# Altium project MC33035_Motor_Driver.PrjPcb
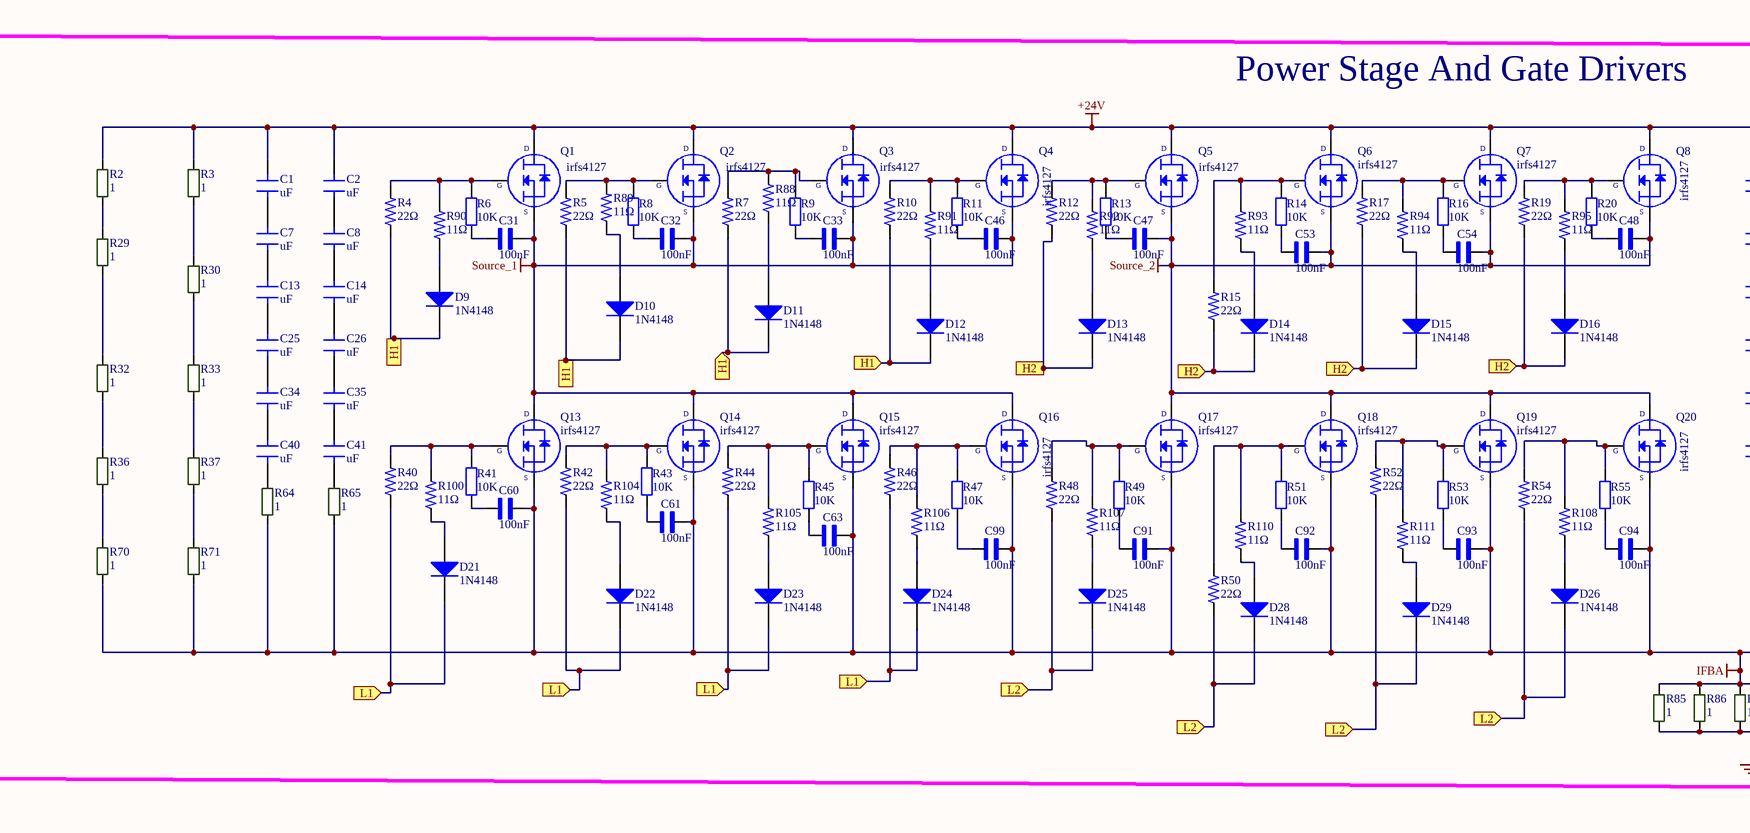
[diagram p0: Mosfet_cct.SchDoc, left]
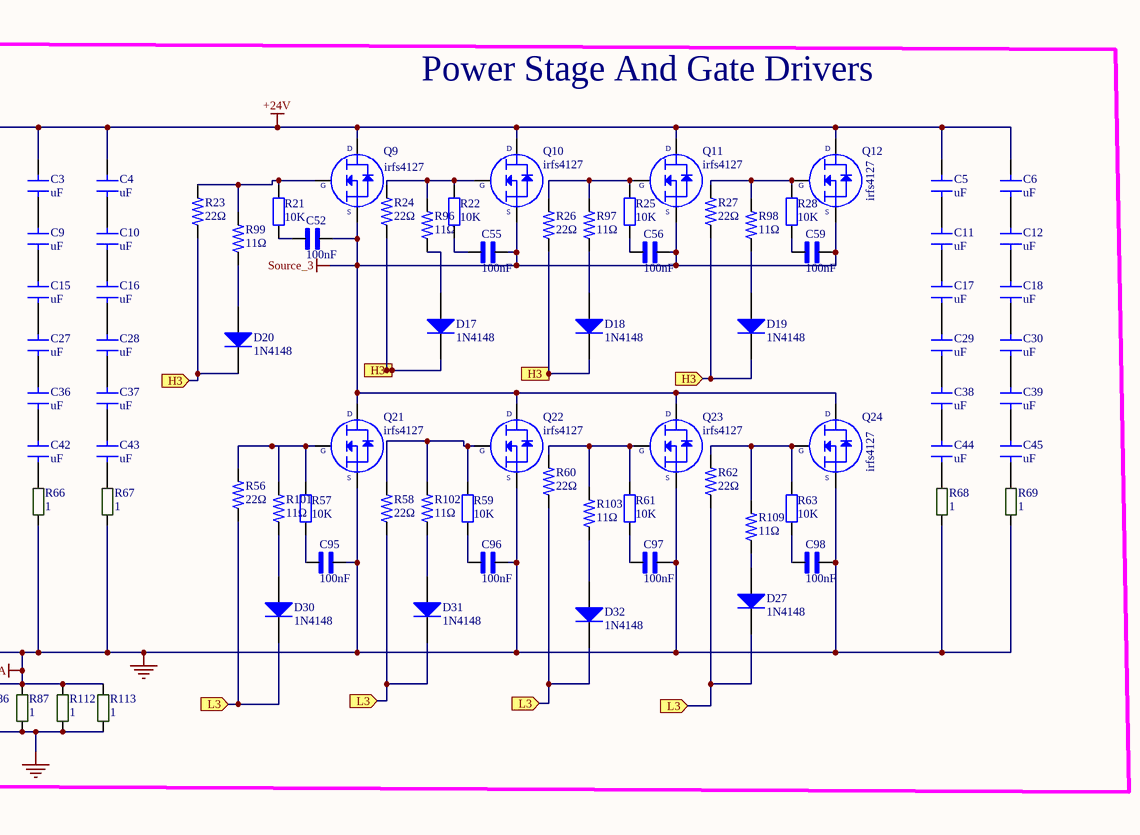
[diagram p1: Mosfet_cct.SchDoc, right]
5 sheets, 276 parts. Net scope: flat (ports and power ports of the same name join across sheets).
Board file: MC33035_Motor_Driver.PcbDoc
Sheets:
  Mosfet_cct.SchDoc
  Gate_Driver_cct.SchDoc
  Regulator_cct.SchDoc
  Parallel_Capacitor.SchDoc
  MC33035_cct.SchDoc

## Sheet Mosfet_cct.SchDoc
size A1

### Parts
C1  uF  [C-1206]
C2  uF  [C-1206]
C3  uF  [C-1206]
C4  uF  [C-1206]
C5  uF  [C-1206]
C6  uF  [C-1206]
C7  uF  [C-1206]
C8  uF  [C-1206]
C9  uF  [C-1206]
C10  uF  [C-1206]
C11  uF  [C-1206]
C12  uF  [C-1206]
C13  uF  [C-1206]
C14  uF  [C-1206]
C15  uF  [C-1206]
C16  uF  [C-1206]
C17  uF  [C-1206]
C18  uF  [C-1206]
C25  uF  [C-1206]
C26  uF  [C-1206]
C27  uF  [C-1206]
C28  uF  [C-1206]
C29  uF  [C-1206]
C30  uF  [C-1206]
C31  100nF  [C-0805W]
C32  100nF  [C-0805W]
C33  100nF  [C-0805W]
C34  uF  [C-1206]
C35  uF  [C-1206]
C36  uF  [C-1206]
C37  uF  [C-1206]
C38  uF  [C-1206]
C39  uF  [C-1206]
C40  uF  [C-1206]
C41  uF  [C-1206]
C42  uF  [C-1206]
C43  uF  [C-1206]
C44  uF  [C-1206]
C45  uF  [C-1206]
C46  100nF  [C-0805W]
C47  100nF  [C-0805W]
C48  100nF  [C-0805W]
C52  100nF  [C-0805W]
C53  100nF  [C-0805W]
C54  100nF  [C-0805W]
C55  100nF  [C-0805W]
C56  100nF  [C-0805W]
C59  100nF  [C-0805W]
C60  100nF  [C-0805W]
C61  100nF  [C-0805W]
C63  100nF  [C-0805W]
C91  100nF  [C-0805W]
C92  100nF  [C-0805W]
C93  100nF  [C-0805W]
C94  100nF  [C-0805W]
C95  100nF  [C-0805W]
C96  100nF  [C-0805W]
C97  100nF  [C-0805W]
C98  100nF  [C-0805W]
C99  100nF  [C-0805W]
D9  1N4148 Diyot  [SOD-123]  (value not drawn)
D10  1N4148 Diyot  [SOD-123]  (value not drawn)
D11  1N4148 Diyot  [SOD-123]  (value not drawn)
D12  1N4148 Diyot  [SOD-123]  (value not drawn)
D13  1N4148 Diyot  [SOD-123]  (value not drawn)
D14  1N4148 Diyot  [SOD-123]  (value not drawn)
D15  1N4148 Diyot  [SOD-123]  (value not drawn)
D16  1N4148 Diyot  [SOD-123]  (value not drawn)
D17  1N4148 Diyot  [SOD-123]  (value not drawn)
D18  1N4148 Diyot  [SOD-123]  (value not drawn)
D19  1N4148 Diyot  [SOD-123]  (value not drawn)
D20  1N4148 Diyot  [SOD-123]  (value not drawn)
D21  1N4148 Diyot  [SOD-123]  (value not drawn)
D22  1N4148 Diyot  [SOD-123]  (value not drawn)
D23  1N4148 Diyot  [SOD-123]  (value not drawn)
D24  1N4148 Diyot  [SOD-123]  (value not drawn)
D25  1N4148 Diyot  [SOD-123]  (value not drawn)
D26  1N4148 Diyot  [SOD-123]  (value not drawn)
D27  1N4148 Diyot  [SOD-123]  (value not drawn)
D28  1N4148 Diyot  [SOD-123]  (value not drawn)
D29  1N4148 Diyot  [SOD-123]  (value not drawn)
D30  1N4148 Diyot  [SOD-123]  (value not drawn)
D31  1N4148 Diyot  [SOD-123]  (value not drawn)
D32  1N4148 Diyot  [SOD-123]  (value not drawn)
Q1  irfs4127  [DPAK_TO263]
Q2  irfs4127  [DPAK_TO263]
Q3  irfs4127  [DPAK_TO263]
Q4  irfs4127  [DPAK_TO263]
Q5  irfs4127  [DPAK_TO263]
Q6  irfs4127  [DPAK_TO263]
Q7  irfs4127  [DPAK_TO263]
Q8  irfs4127  [DPAK_TO263]
Q9  irfs4127  [DPAK_TO263]
Q10  irfs4127  [DPAK_TO263]
Q11  irfs4127  [DPAK_TO263]
Q12  irfs4127  [DPAK_TO263]
Q13  irfs4127  [DPAK_TO263]
Q14  irfs4127  [DPAK_TO263]
Q15  irfs4127  [DPAK_TO263]
Q16  irfs4127  [DPAK_TO263]
Q17  irfs4127  [DPAK_TO263]
Q18  irfs4127  [DPAK_TO263]
Q19  irfs4127  [DPAK_TO263]
Q20  irfs4127  [DPAK_TO263]
Q21  irfs4127  [DPAK_TO263]
Q22  irfs4127  [DPAK_TO263]
Q23  irfs4127  [DPAK_TO263]
Q24  irfs4127  [DPAK_TO263]
R2  1  [R-2512W]
R3  1  [R-2512W]
R4  22Ω  [R-1206W]
R5  22Ω  [R-1206W]
R6  Deger: 10K  [R-0805W]  (hidden comment: RES SMD 10K OHM 1% 1/8W 0805)
R7  22Ω  [R-1206W]
R8  Deger: 10K  [R-0805W]  (hidden comment: RES SMD 10K OHM 1% 1/8W 0805)
R9  Deger: 10K  [R-0805W]  (hidden comment: RES SMD 10K OHM 1% 1/8W 0805)
R10  22Ω  [R-1206W]
R11  Deger: 10K  [R-0805W]  (hidden comment: RES SMD 10K OHM 1% 1/8W 0805)
R12  22Ω  [R-1206W]
R13  Deger: 10K  [R-0805W]  (hidden comment: RES SMD 10K OHM 1% 1/8W 0805)
R14  Deger: 10K  [R-0805W]  (hidden comment: RES SMD 10K OHM 1% 1/8W 0805)
R15  22Ω  [R-1206W]
R16  Deger: 10K  [R-0805W]  (hidden comment: RES SMD 10K OHM 1% 1/8W 0805)
R17  22Ω  [R-1206W]
R19  22Ω  [R-1206W]
R20  Deger: 10K  [R-0805W]  (hidden comment: RES SMD 10K OHM 1% 1/8W 0805)
R21  Deger: 10K  [R-0805W]  (hidden comment: RES SMD 10K OHM 1% 1/8W 0805)
R22  Deger: 10K  [R-0805W]  (hidden comment: RES SMD 10K OHM 1% 1/8W 0805)
R23  22Ω  [R-1206W]
R24  22Ω  [R-1206W]
R25  Deger: 10K  [R-0805W]  (hidden comment: RES SMD 10K OHM 1% 1/8W 0805)
R26  22Ω  [R-1206W]
R27  22Ω  [R-1206W]
R28  Deger: 10K  [R-0805W]  (hidden comment: RES SMD 10K OHM 1% 1/8W 0805)
R29  1  [R-2512W]
R30  1  [R-2512W]
R32  1  [R-2512W]
R33  1  [R-2512W]
R36  1  [R-2512W]
R37  1  [R-2512W]
R40  22Ω  [R-1206W]
R41  Deger: 10K  [R-0805W]  (hidden comment: RES SMD 10K OHM 1% 1/8W 0805)
R42  22Ω  [R-1206W]
R43  Deger: 10K  [R-0805W]  (hidden comment: RES SMD 10K OHM 1% 1/8W 0805)
R44  22Ω  [R-1206W]
R45  Deger: 10K  [R-0805W]  (hidden comment: RES SMD 10K OHM 1% 1/8W 0805)
R46  22Ω  [R-1206W]
R47  Deger: 10K  [R-0805W]  (hidden comment: RES SMD 10K OHM 1% 1/8W 0805)
R48  22Ω  [R-1206W]
R49  Deger: 10K  [R-0805W]  (hidden comment: RES SMD 10K OHM 1% 1/8W 0805)
R50  22Ω  [R-1206W]
R51  Deger: 10K  [R-0805W]  (hidden comment: RES SMD 10K OHM 1% 1/8W 0805)
R52  22Ω  [R-1206W]
R53  Deger: 10K  [R-0805W]  (hidden comment: RES SMD 10K OHM 1% 1/8W 0805)
R54  22Ω  [R-1206W]
R55  Deger: 10K  [R-0805W]  (hidden comment: RES SMD 10K OHM 1% 1/8W 0805)
R56  22Ω  [R-1206W]
R57  Deger: 10K  [R-0805W]  (hidden comment: RES SMD 10K OHM 1% 1/8W 0805)
R58  22Ω  [R-1206W]
R59  Deger: 10K  [R-0805W]  (hidden comment: RES SMD 10K OHM 1% 1/8W 0805)
R60  22Ω  [R-1206W]
R61  Deger: 10K  [R-0805W]  (hidden comment: RES SMD 10K OHM 1% 1/8W 0805)
R62  22Ω  [R-1206W]
R63  Deger: 10K  [R-0805W]  (hidden comment: RES SMD 10K OHM 1% 1/8W 0805)
R64  1  [R-2512W]
R65  1  [R-2512W]
R66  1  [R-2512W]
R67  1  [R-2512W]
R68  1  [R-2512W]
R69  1  [R-2512W]
R70  1  [R-2512W]
R71  1  [R-2512W]
R85  1  [R-2512W]
R86  1  [R-2512W]
R87  1  [R-2512W]
R88  11Ω  [R-1206W]
R89  11Ω  [R-1206W]
R90  11Ω  [R-1206W]
R91  11Ω  [R-1206W]
R92  11Ω  [R-1206W]
R93  11Ω  [R-1206W]
R94  11Ω  [R-1206W]
R95  11Ω  [R-1206W]
R96  11Ω  [R-1206W]
R97  11Ω  [R-1206W]
R98  11Ω  [R-1206W]
R99  11Ω  [R-1206W]
R100  11Ω  [R-1206W]
R101  11Ω  [R-1206W]
R102  11Ω  [R-1206W]
R103  11Ω  [R-1206W]
R104  11Ω  [R-1206W]
R105  11Ω  [R-1206W]
R106  11Ω  [R-1206W]
R107  11Ω  [R-1206W]
R108  11Ω  [R-1206W]
R109  11Ω  [R-1206W]
R110  11Ω  [R-1206W]
R111  11Ω  [R-1206W]
R112  1  [R-2512W]
R113  1  [R-2512W]

### Ports
H1 (in), H2 (in), H3 (in), L1 (in), L2 (in), L3 (in)

### Nets
+24V: C1.2 C2.2 C3.2 C4.2 C5.2 C6.2 Q1.3 Q2.3 Q3.3 Q4.3 Q5.3 Q6.3 Q7.3 Q8.3 Q9.3 Q10.3 Q11.3 Q12.3 R2.2 R3.2
GND: C60.2 C61.2 C63.2 C91.2 C92.2 C93.2 C94.2 C95.2 C96.2 C97.2 C98.2 C99.2 Q13.2 Q14.2 Q15.2 Q16.2 Q17.2 Q18.2 Q19.2 Q20.2 Q21.2 Q22.2 Q23.2 Q24.2 R64.1 R65.1 R66.1 R67.1 R68.1 R69.1 R70.1 R71.1 R85.1 R85.2 R86.1 R86.2 R87.1 R87.2 R112.1 R112.2 R113.1 R113.2  [also labelled IFBA]
Source_1: C31.2 C32.2 C33.2 C46.2 Q1.2 Q2.2 Q3.2 Q4.2 Q13.3 Q14.3 Q15.3 Q16.3
Source_2: C47.2 C48.2 C53.2 C54.2 Q5.2 Q6.2 Q7.2 Q8.2 Q17.3 Q18.3 Q19.3 Q20.3
Source_3: C52.2 C55.2 C56.2 C59.2 Q9.2 Q10.2 Q11.2 Q12.2 Q21.3 Q22.3 Q23.3 Q24.3
NetC1_1: C1.1 C7.2
NetC2_1: C2.1 C8.2
NetC3_1: C3.1 C9.2
NetC4_1: C4.1 C10.2
NetC5_1: C5.1 C11.2
NetC6_1: C6.1 C12.2
NetC7_1: C7.1 C13.2
NetC8_1: C8.1 C14.2
NetC9_1: C9.1 C15.2
NetC10_1: C10.1 C16.2
NetC11_1: C11.1 C17.2
NetC12_1: C12.1 C18.2
NetC13_1: C13.1 C25.2
NetC14_1: C14.1 C26.2
NetC15_1: C15.1 C27.2
NetC16_1: C16.1 C28.2
NetC17_1: C17.1 C29.2
NetC18_1: C18.1 C30.2
NetC25_1: C25.1 C34.2
NetC26_1: C26.1 C35.2
NetC27_1: C27.1 C36.2
NetC28_1: C28.1 C37.2
NetC29_1: C29.1 C38.2
NetC30_1: C30.1 C39.2
NetC31_1: C31.1 R6.1
NetC32_1: C32.1 R8.1
NetC33_1: C33.1 R9.1
NetC34_1: C34.1 C40.2
NetC35_1: C35.1 C41.2
NetC36_1: C36.1 C42.2
NetC37_1: C37.1 C43.2
NetC38_1: C38.1 C44.2
NetC39_1: C39.1 C45.2
NetC40_1: C40.1 R64.2
NetC41_1: C41.1 R65.2
NetC42_1: C42.1 R66.2
NetC43_1: C43.1 R67.2
NetC44_1: C44.1 R68.2
NetC45_1: C45.1 R69.2
NetC46_1: C46.1 R11.1
NetC47_1: C47.1 R13.1
NetC48_1: C48.1 R20.1
NetC52_1: C52.1 R21.1
NetC53_1: C53.1 R14.1
NetC54_1: C54.1 R16.1
NetC55_1: C55.1 R22.1
NetC56_1: C56.1 R25.1
NetC59_1: C59.1 R28.1
NetC60_1: C60.1 R41.1
NetC61_1: C61.1 R43.1
NetC63_1: C63.1 R45.1
NetC91_1: C91.1 R49.1
NetC92_1: C92.1 R51.1
NetC93_1: C93.1 R53.1
NetC94_1: C94.1 R55.1
NetC95_1: C95.1 R57.1
NetC96_1: C96.1 R59.1
NetC97_1: C97.1 R61.1
NetC98_1: C98.1 R63.1
NetC99_1: C99.1 R47.1
NetD9_1: D9.1(A) R90.1
NetD9_2: D9.2(K) D10.2(K) D11.2(K) D12.2(K) R4.1 R5.1 R7.1 R10.1 ; port H1
NetD10_1: D10.1(A) R89.1
NetD11_1: D11.1(A) R88.1
NetD12_1: D12.1(A) R91.1
NetD13_1: D13.1(A) R92.1
NetD13_2: D13.2(K) D14.2(K) D15.2(K) D16.2(K) R12.1 R15.1 R17.1 R19.1 ; port H2
NetD14_1: D14.1(A) R93.1
NetD15_1: D15.1(A) R94.1
NetD16_1: D16.1(A) R95.1
NetD17_1: D17.1(A) R96.1
NetD17_2: D17.2(K) D18.2(K) D19.2(K) D20.2(K) R23.1 R24.1 R26.1 R27.1 ; port H3
NetD18_1: D18.1(A) R97.1
NetD19_1: D19.1(A) R98.1
NetD20_1: D20.1(A) R99.1
NetD21_1: D21.1(A) R100.1
NetD21_2: D21.2(K) D22.2(K) D23.2(K) D24.2(K) R40.1 R42.1 R44.1 R46.1 ; port L1
NetD22_1: D22.1(A) R104.1
NetD23_1: D23.1(A) R105.1
NetD24_1: D24.1(A) R106.1
NetD25_1: D25.1(A) R107.1
NetD25_2: D25.2(K) D26.2(K) D28.2(K) D29.2(K) R48.1 R50.1 R52.1 R54.1 ; port L2
NetD26_1: D26.1(A) R108.1
NetD27_1: D27.1(A) R109.1
NetD27_2: D27.2(K) D30.2(K) D31.2(K) D32.2(K) R56.1 R58.1 R60.1 R62.1 ; port L3
NetD28_1: D28.1(A) R110.1
NetD29_1: D29.1(A) R111.1
NetD30_1: D30.1(A) R101.1
NetD31_1: D31.1(A) R102.1
NetD32_1: D32.1(A) R103.1
NetQ1_1: Q1.1 R4.2 R6.2 R90.2
NetQ2_1: Q2.1 R5.2 R8.2 R89.2
NetQ3_1: Q3.1 R7.2 R9.2 R88.2
NetQ4_1: Q4.1 R10.2 R11.2 R91.2
NetQ5_1: Q5.1 R12.2 R13.2 R92.2
NetQ6_1: Q6.1 R14.2 R15.2 R93.2
NetQ7_1: Q7.1 R16.2 R17.2 R94.2
NetQ8_1: Q8.1 R19.2 R20.2 R95.2
NetQ9_1: Q9.1 R21.2 R23.2 R99.2
NetQ10_1: Q10.1 R22.2 R24.2 R96.2
NetQ11_1: Q11.1 R25.2 R26.2 R97.2
NetQ12_1: Q12.1 R27.2 R28.2 R98.2
NetQ13_1: Q13.1 R40.2 R41.2 R100.2
NetQ14_1: Q14.1 R42.2 R43.2 R104.2
NetQ15_1: Q15.1 R44.2 R45.2 R105.2
NetQ16_1: Q16.1 R46.2 R47.2 R106.2
NetQ17_1: Q17.1 R48.2 R49.2 R107.2
NetQ18_1: Q18.1 R50.2 R51.2 R110.2
NetQ19_1: Q19.1 R52.2 R53.2 R111.2
NetQ20_1: Q20.1 R54.2 R55.2 R108.2
NetQ21_1: Q21.1 R56.2 R57.2 R101.2
NetQ22_1: Q22.1 R58.2 R59.2 R102.2
NetQ23_1: Q23.1 R60.2 R61.2 R103.2
NetQ24_1: Q24.1 R62.2 R63.2 R109.2
NetR2_1: R2.1 R29.2
NetR3_1: R3.1 R30.2
NetR29_1: R29.1 R32.2
NetR30_1: R30.1 R33.2
NetR32_1: R32.1 R36.2
NetR33_1: R33.1 R37.2
NetR36_1: R36.1 R70.2
NetR37_1: R37.1 R71.2

### Notes on the sheet
- Power Stage And Gate Drivers
- (in symbol IRFS4127TRLPBF) D; G; S

### Library data of the parts
C1-C18 C25-C30 C34-C45 = C-1206
C31-C33 C46-C48 C52-C56 C59-C61 C63 C91-C99 = CAP 100nF 50V SMT 0805: WCAP-CSGP General Purpose MLCC; SMT 0805; X7R; 100nF 10%; 50V; -55C to +125C; Tech. PN X7R0805104K050DFCT10000; MF: Wurth Electronics Inc; MP: 885012207098; Availability: Warning; Mouser-Purchase-URL: https://snapeda.com/shop?store=Mouser&id=4217223; Price: None; DigiKey-Purchase-URL: https://snapeda.com/shop?store=DigiKey&id=4217223; Package: 0805 Wurth Electronics; Value: *; SnapEDA_Link: https://www.snapeda.com/parts/885012207098/Wurth%20Electronics%20Inc/view-part/4217223/?ref=snap; BuyPart: https://www.snapeda.com/parts/885012207098/Wurth%20Electronics%20Inc/view-part/4217223/?ref=eda
D9-D32 = 1N4148: DIODE GEN PURP 100V 150MA SOD123; Uretici Kodu: 1N4148W-TP; -Sicaklik: -65; +Sicaklik: +150; Lehim Yöntemi: SMD; Cins: Diyot; Kılıf: SOD123; MSL: 1 (Unlimited); Deger: 1N4148
Q1-Q24 = IRFS4127TRLPBF: MOSFET N-CH 200V 72A D2PAK; Manufacturer: International Rectifier; Rds On Max: 22mR; Input Capacitance: 5.38nF; Rise Time: 18ns; Max Power Dissipation: 375W; Fall Time: 22ns; Turn-Off Delay Time: 56ns; Turn-On Delay Time: 17ns; Element Configuration: Single; Gate to Source Voltage (Vgs): 20V; Supplier 1: Digi-Key; Manufacturer Part Number: IRFS4127TRLPBF; RoHS: Yes; Stock 1: 15054; Pricing 1: 1 = 3,97000, 10 = 3,54100, 100 = 2,90330 (USD); Mount: Surface Mount; Case/Package: D2PAK; Number of Pins: 3; Min Operating Temperature: -55°C; Max Operating Temperature: 175°C; Package Quantity: 1; Packaging: Tape and Reel; Drain to Source Voltage (Vdss): 200V; Continuous Drain Current (ID): 72A; Drain to Source Breakdown Voltage: 200V; Drain to Source Resistance: 22mR; Power Dissipation: 375W; On-State Resistance: 22MR; ComponentLink1URL: https://datasheet.ciiva.com/939/irfs4127pbf-939456.pdf?src-supplier=Digi-Key; ComponentLink1Description: https://datasheet.ciiva.com/939/irfs4127pbf-939456.pdf?src-supplier=Digi-Key; ComponentLink2URL: https://datasheet.ciiva.com/939/irfs4127pbf-939457.pdf?src-supplier=Digi-Key; ComponentLink2Description: https://datasheet.ciiva.com/939/irfs4127pbf-939457.pdf?src-supplier=Digi-Key; ComponentLink3URL: https://datasheet.ciiva.com/939/irfs4127pbf-939458.pdf?src-supplier=Digi-Key; ComponentLink3Description: https://datasheet.ciiva.com/939/irfs4127pbf-939458.pdf?src-supplier=Digi-Key; ComponentLink4URL: https://datasheet.ciiva.com/16221/irfs4127pbf-16221031.pdf?src-supplier=Future+Electronics; ComponentLink4Description: https://datasheet.ciiva.com/16221/irfs4127pbf-16221031.pdf?src-supplier=Future+Electronics; Supplier Part Number 1: IRFS4127TRLPBFCT-ND
R2 R3 R29 R30 R32 R33 R36 R37 R64-R71 R85-R87 R112 R113 = 0207 melf: ComponentLink1Description: https://www.ozdisan.com/pasif-komponentler/direncler/smt-smd-direncler/M271UFG100KT20; ComponentLink1URL: https://www.ozdisan.com/pasif-komponentler/direncler/smt-smd-direncler/M271UFG100KT20
R4 R5 R7 R10 R12 R15 R17 R19 R23 R24 R26 R27 R40 R42 R44 R46 R48 R50 R52 R54 R56 R58 R60 R62 = RES 22Ω 1206: CRG1206 1% 22R; MP: 1623463-1; Package: None; Price: None; Value: *; Availability: Unavailable
R6 R8 R9 R11 R13 R14 R16 R20-R22 R25 R28 R41 R43 R45 R47 R49 R51 R53 R55 R57 R59 R61 R63 = 10K 0805: 10 kOhms ±1% 0.125W, 1/8W Chip Resistor 0805 (2012 Metric) Moisture Resistant Thick Film; Cins: Direnc; Kılıf: 0805; Uretici Kodu: RC0805FR-0710KL; -Sicaklik: -55; +Sicaklik: +155; Lehim Yöntemi: SMD; MSL: 1 (Unlimited)
R88-R111 = RES 11Ω 1206: CRG1206 1% 11R; MP: 1623463-1; Package: None; Price: None; Value: *; Availability: Unavailable

## Sheet Gate_Driver_cct.SchDoc
size A3
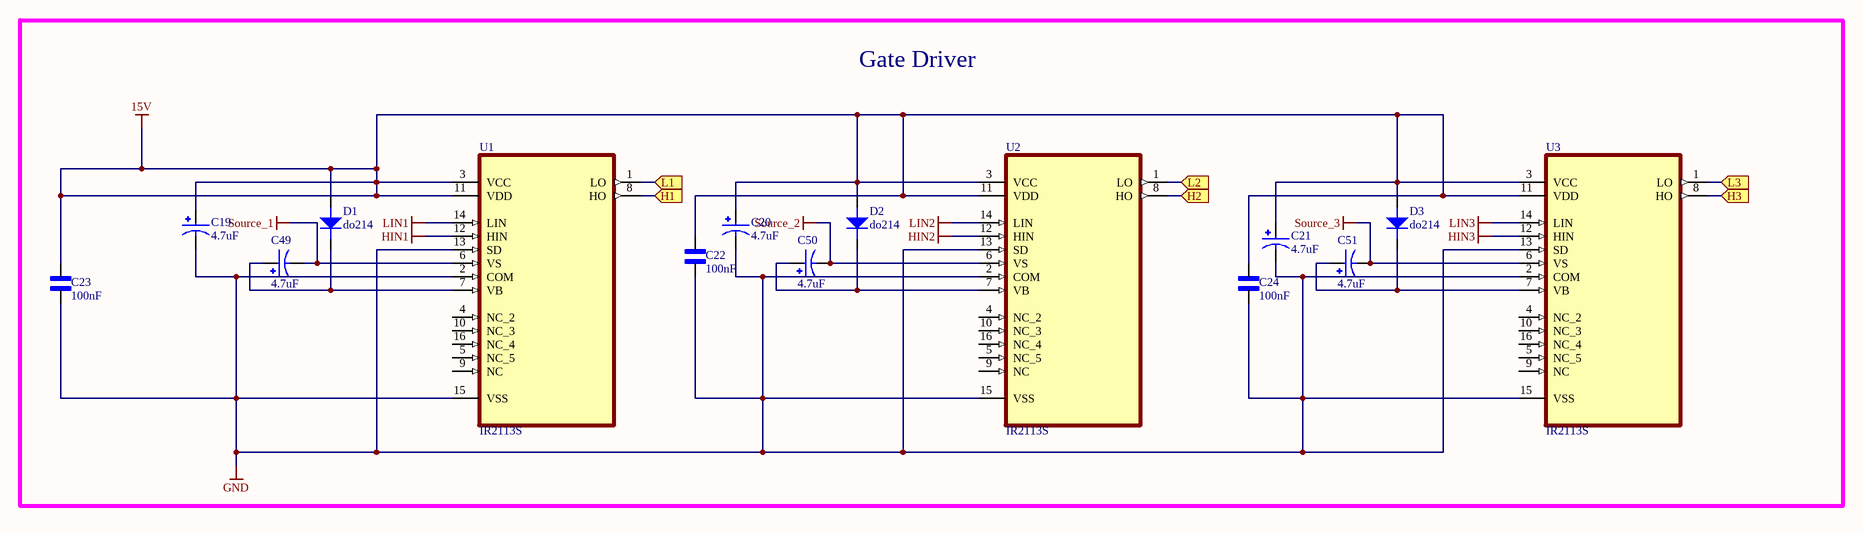
[diagram p2: Gate_Driver_cct.SchDoc]

### Parts
C19  4.7uF  [CAP ALSMD POLY 4.3MM H5.5MM]
C20  4.7uF  [CAP ALSMD POLY 4.3MM H5.5MM]
C21  4.7uF  [CAP ALSMD POLY 4.3MM H5.5MM]
C22  100nF  [C-0805W]
C23  100nF  [C-0805W]
C24  100nF  [C-0805W]
C49  4.7uF  [CAP ALSMD POLY 4.3MM H5.5MM]
C50  4.7uF  [CAP ALSMD POLY 4.3MM H5.5MM]
C51  4.7uF  [CAP ALSMD POLY 4.3MM H5.5MM]
D1  do214  [DO-214AC]
D2  do214  [DO-214AC]
D3  do214  [DO-214AC]
U1  IR2113S  [SOIC127P1032X265-16N]
U2  IR2113S  [SOIC127P1032X265-16N]
U3  IR2113S  [SOIC127P1032X265-16N]

### Blocks framed on the sheet
Gate Driver: C19-C24 C49-C51 D1-D3 U1-U3

### Ports
H1 (in), H2 (in), H3 (in), L1 (in), L2 (in), L3 (in)

### Nets
15V: C19.1 C20.1 C21.1 C22.1 C23.1 C24.1 D1.a D2.a D3.a U1.3(VCC) U1.11(VDD) U2.3(VCC) U2.11(VDD) U3.3(VCC) U3.11(VDD)
GND: C19.2 C20.2 C21.2 C22.2 C23.2 C24.2 U1.2(COM) U1.13(SD) U1.15(VSS) U2.2(COM) U2.13(SD) U2.15(VSS) U3.2(COM) U3.13(SD) U3.15(VSS)
HIN1: U1.12(HIN)
HIN2: U2.12(HIN)
HIN3: U3.12(HIN)
LIN1: U1.14(LIN)
LIN2: U2.14(LIN)
LIN3: U3.14(LIN)
Source_1: C49.2 U1.6(VS)
Source_2: C50.2 U2.6(VS)
Source_3: C51.2 U3.6(VS)
NetC49_1: C49.1 D1.k U1.7(VB)
NetC50_1: C50.1 D2.k U2.7(VB)
NetC51_1: C51.1 D3.k U3.7(VB)
NetD9_2: U1.8(HO) ; port H1
NetD13_2: U2.8(HO) ; port H2
NetD17_2: U3.8(HO) ; port H3
NetD21_2: U1.1(LO) ; port L1
NetD25_2: U2.1(LO) ; port L2
NetD27_2: U3.1(LO) ; port L3

Not connected (* = marked no-connect by the designer): U1 4(NC_2) 5(NC_5) 9(NC) 10(NC_3) 16(NC_4); U2 4(NC_2) 5(NC_5) 9(NC) 10(NC_3) 16(NC_4); U3 4(NC_2) 5(NC_5) 9(NC) 10(NC_3) 16(NC_4)

### Library data of the parts
C19-C21 C49-C51 = CAP 4.7uF
C22-C24 = CAP 100nF 50V SMT 0805: as C31 on sheet Mosfet_cct; Availability: Warning; Mouser-Purchase-URL: https://snapeda.com/shop?store=Mouser&id=4217223; Price: None; DigiKey-Purchase-URL: https://snapeda.com/shop?store=DigiKey&id=4217223; Package: 0805 Wurth Electronics; Value: *; SnapEDA_Link: https://www.snapeda.com/parts/885012207098/Wurth%20Electronics%20Inc/view-part/4217223/?ref=snap; BuyPart: https://www.snapeda.com/parts/885012207098/Wurth%20Electronics%20Inc/view-part/4217223/?ref=eda
D1-D3 = do214: DIODE FAST SWITCHING Single 150mA 75V SMT SOD323
U1-U3 = IR2113S: Half-Bridge Gate Driver IC Non-Inverting 16-SOIC; MF: Infineon Technologies; Value: *; SnapEDA_Link: https://www.snapeda.com/parts/IR2113S/Infineon%20Technologies/view-part/577803/?ref=snap; Package: SOIC-16 Infineon; MP: IR2113S; Availability: Unavailable; Price: None

## Sheet Regulator_cct.SchDoc
size A4
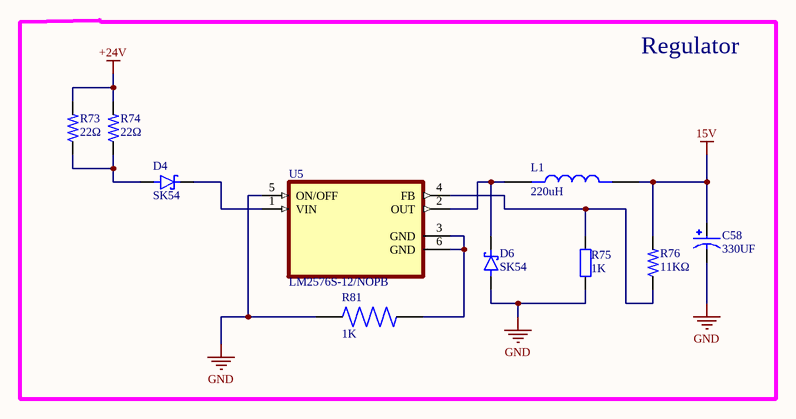
[diagram p3: Regulator_cct.SchDoc]

### Parts
C58  330UF  [CAP_EEETC1C331V]
D4  SK54  [DIOM7959X265N]
D6  SK54  [DIOM7959X265N]
L1  220uH  [IND_MDH12577C-101MA=P3]
R73  22Ω  [R-2512R]
R74  22Ω  [R-2512R]
R75  Deger: 1K  [R-0805W]  (hidden comment: RES SMD 1K OHM 1% 1/8W 0805)
R76  11KΩ  [R-0805R]
R81  1K  [RESC6332X65N]
U5  LM2576S-12/NOPB  [VREG_TPS79625KTTR]

### Blocks framed on the sheet
Regulator: C58 D4 D6 L1 R73-R76 R81 U5

### Nets
15V: C58.1 L1.2 R76.2
+24V: R73.2 R74.2
GND: C58.2 D6.A R75.1 R81.1 U5.5(ON/OFF)
NetD4_A: D4.A R73.1 R74.1
NetD4_C: D4.C(K) U5.1(VIN)
NetD6_C: D6.C(K) L1.1 U5.2(OUT)
NetR75_2: R75.2 R76.1 U5.4(FB)
NetR81_2: R81.2 U5.3(GND) U5.6(GND)

### Library data of the parts
C58 = CAP 330UF SMD: CAP ALUM 330UF 20% 16V SMD; MP: EEE-TC1C331V; MF: Panasonic Electronic Components; Value: *; Package: RADIAL-2 Panasonic; Availability: In Stock; SnapEDA_Link: https://www.snapeda.com/parts/EEE-TC1C331V/Panasonic/view-part/6178283/?ref=snap; Price: None; Purchase-URL: https://pricing.snapeda.com/search/part/EEE-TC1C331V/?ref=eda; Check_prices: https://www.snapeda.com/parts/EEE-TC1C331V/Panasonic/view-part/6178283/?ref=eda
D4 D6 = SK54: Diode Schottky 40V 5A Surface Mount DO-214AA (SMB); MP: MBRS320T3G; MF: ON Semiconductor; Package: DO-214 ON Semiconductor; Availability: Good; Arrow_Electronics-Purchase-URL: https://snapeda.com/shop?store=Arrow+Electronics&id=432205; SnapEDA_Link: https://www.snapeda.com/parts/MBRS320T3G/ON%20Semiconductor/view-part/432205/?ref=snap; DigiKey-Purchase-URL: https://snapeda.com/shop?store=DigiKey&id=432205; Mouser-Purchase-URL: https://snapeda.com/shop?store=Mouser&id=432205; Value: *; Price: None
L1 = 220uH Inductor SMD: Inductor Power Shielded Wirewound 220uH 20% 100KHz Ferrite 1.1A 0.325Ohm DCR 5049 Automotive T/R; MP: MDH12577C-101MA=P3; Package: None; Price: None; Value: *; Availability: Unavailable
R73 R74 = RES 22Ω 2512
R75 = 1K 0805: 1 kOhms ±1% 0.125W, 1/8W Chip Resistor 0805 (2012 Metric) Moisture Resistant Thick Film; Cins: Direnc; Uretici Kodu: RC0805FR-071KL; Kılıf: 0805; -Sicaklik: -55; +Sicaklik: +155; Lehim Yöntemi: SMD; MSL: 1 (Unlimited)
R76 = RES 11KΩ SMD: THICK FILM RESISTOR, 11KOHM, 125mW, 5%; MP: CRCW080511K0JNEA; Package: None; Price: None; Value: *; Availability: Unavailable
R81 = RES 1K 2512: Fixed Resistor CRGP 2512 1K0 1%; MF: TE Connectivity; MP: CRGP2512F1K0; Mouser-Purchase-URL: https://snapeda.com/shop?store=Mouser&id=3188667; Package: 6332 TE Connectivity; Price: None; Value: *; SnapEDA_Link: https://www.snapeda.com/parts/CRGP2512F1K0/TE%20Connectivity/view-part/3188667/?ref=snap; DigiKey-Purchase-URL: https://snapeda.com/shop?store=DigiKey&id=3188667; Availability: Unavailable
U5 = LM2576S-12/NOPB: SIMPLE SWITCHER&reg; 40V, 3A Low Component Count Step-Down Regulator 5-DDPAK/TO-263 -40 to 125; MF: Texas Instruments; Availability: Warning; SnapEDA_Link: https://www.snapeda.com/parts/LM2576S-12/NOPB/Texas%20Instruments/view-part/470772/?ref=snap; Mouser-Purchase-URL: https://snapeda.com/shop?store=Mouser&id=470772; Texas_Instruments-Purchase-URL: https://snapeda.com/shop?store=Texas+Instruments&id=470772; Value: *; Price: None; Package: TO-263-5 Texas Instruments; DigiKey-Purchase-URL: https://snapeda.com/shop?store=DigiKey&id=470772; MP: LM2576S-12/NOPB; BuyPart: https://www.snapeda.com/parts/LM2576S-12/NOPB/Texas%20Instruments/view-part/470772/?ref=eda

## Sheet Parallel_Capacitor.SchDoc
size A4
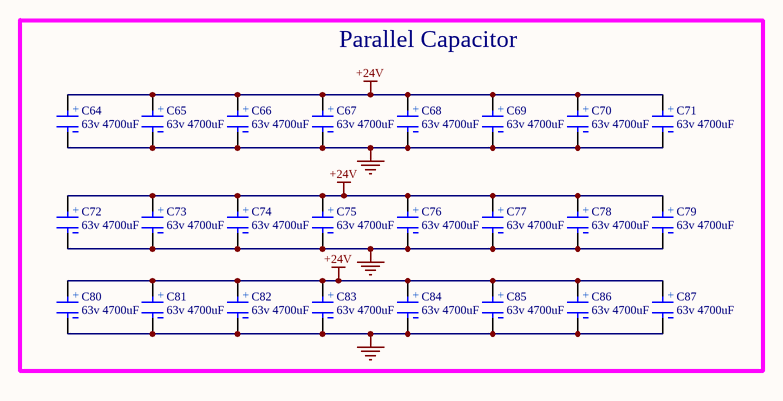
[diagram p4: Parallel_Capacitor.SchDoc]

### Parts
C64  63v 4700uF  [cap 10*20]
C65  63v 4700uF  [cap 10*20]
C66  63v 4700uF  [cap 10*20]
C67  63v 4700uF  [cap 10*20]
C68  63v 4700uF  [cap 10*20]
C69  63v 4700uF  [cap 10*20]
C70  63v 4700uF  [cap 10*20]
C71  63v 4700uF  [cap 10*20]
C72  63v 4700uF  [cap 10*20]
C73  63v 4700uF  [cap 10*20]
C74  63v 4700uF  [cap 10*20]
C75  63v 4700uF  [cap 10*20]
C76  63v 4700uF  [cap 10*20]
C77  63v 4700uF  [cap 10*20]
C78  63v 4700uF  [cap 10*20]
C79  63v 4700uF  [cap 10*20]
C80  63v 4700uF  [cap 10*20]
C81  63v 4700uF  [cap 10*20]
C82  63v 4700uF  [cap 10*20]
C83  63v 4700uF  [cap 10*20]
C84  63v 4700uF  [cap 10*20]
C85  63v 4700uF  [cap 10*20]
C86  63v 4700uF  [cap 10*20]
C87  63v 4700uF  [cap 10*20]

### Blocks framed on the sheet
Parallel Capacitor: C64-C87

### Nets
+24V: C64.1 C65.1 C66.1 C67.1 C68.1 C69.1 C70.1 C71.1 C72.1 C73.1 C74.1 C75.1 C76.1 C77.1 C78.1 C79.1 C80.1 C81.1 C82.1 C83.1 C84.1 C85.1 C86.1 C87.1
GND: C64.2 C65.2 C66.2 C67.2 C68.2 C69.2 C70.2 C71.2 C72.2 C73.2 C74.2 C75.2 C76.2 C77.2 C78.2 C79.2 C80.2 C81.2 C82.2 C83.2 C84.2 C85.2 C86.2 C87.2

### Notes on the sheet
- (in symbol capacitor 10*20) +

### Library data of the parts
C64-C87 = capacitor 10*20: PKL5-063V472MM450 Aluminum Electrolytic Capacitors - Snap In 63volts 4700uF 20%; Manufacturer: Nichicon; Manufacturer Part Number: LKS1J472MESZ; Capacitance: 4.7mF; Ripple Current: 3A; Life (Hours): 1000Hour; Supplier 1: Mouser; RoHS: Yes; Mount: Through Hole; Case/Package: Radial; Min Operating Temperature: -40°C; Max Operating Temperature: 85°C; Package Quantity: 250; Voltage Rating: 63V; Tolerance: 20%; Packaging: Bulk; Voltage Rating (DC): 63V; Termination: Snap in; Diameter: 22mm; Length: 45mm; Lead Pitch: 0.394inch; Height - Seated (Max): 1.772inch; Supplier Part Number 1: 647-LKS1J472MESZ; ComponentLink2Description: https://www.ozdisan.com/pasif-komponentler/kondansatorler/aluminyum-kondansatorler/PKL5-063V472MM450; ComponentLink2URL: https://www.ozdisan.com/pasif-komponentler/kondansatorler/aluminyum-kondansatorler/PKL5-063V472MM450

## Sheet MC33035_cct.SchDoc
size A4
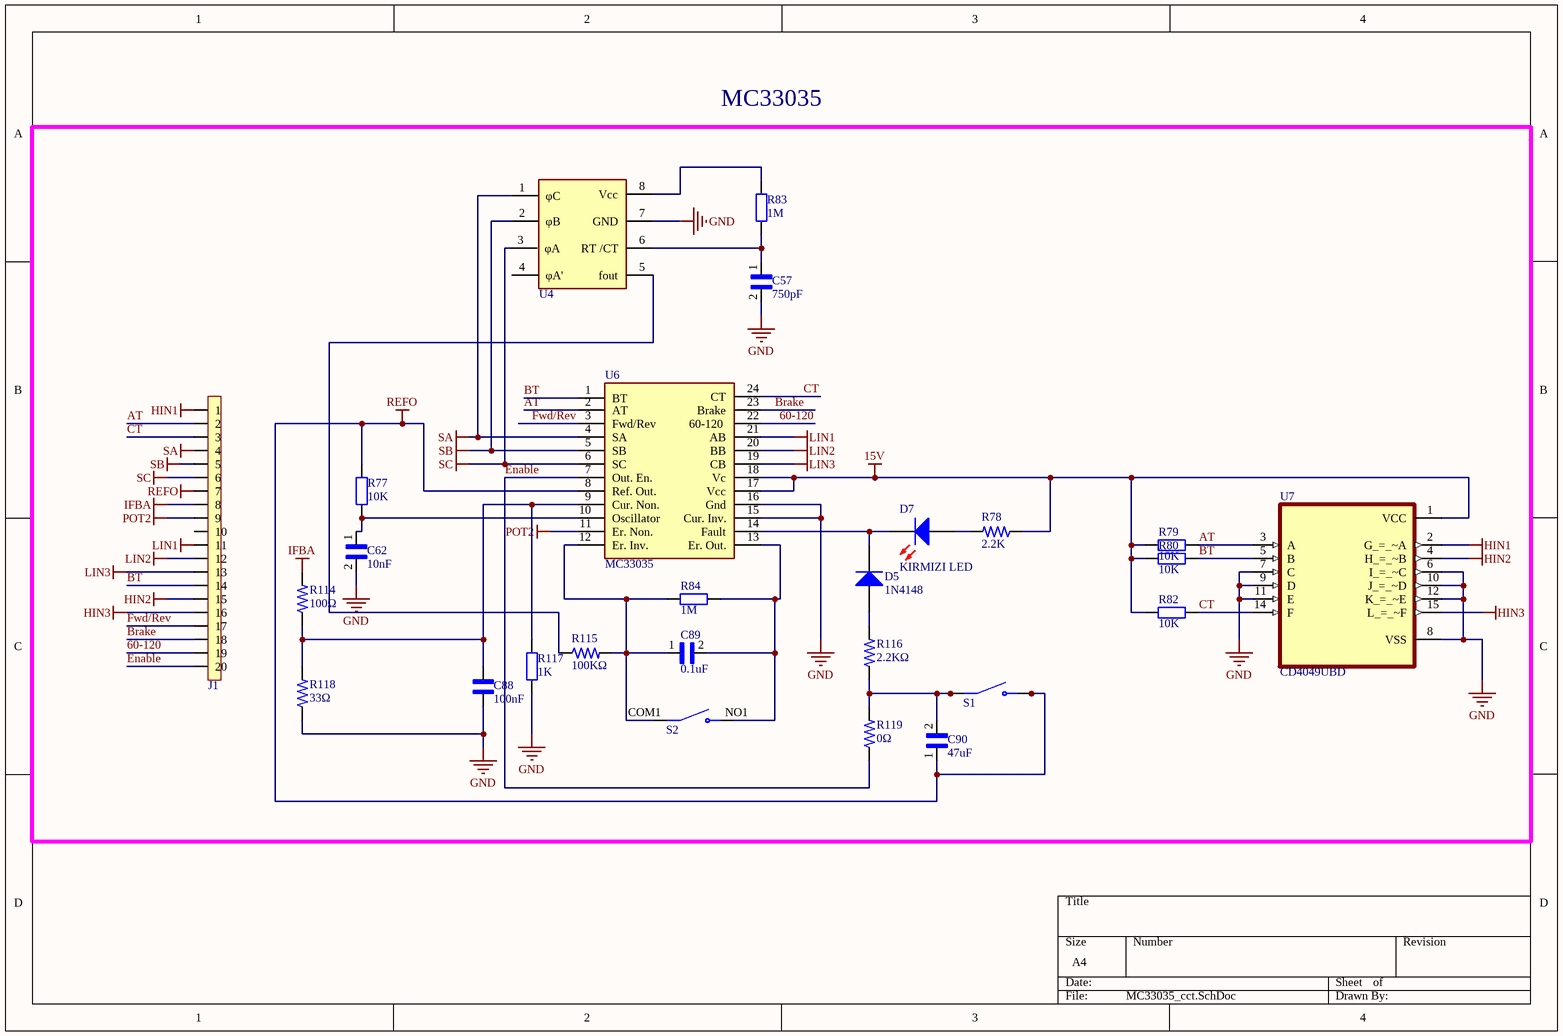
[diagram p5: MC33035_cct.SchDoc]

### Parts
C57  750pF  [CAPC1608X87N]
C62  10nF  [C-0805W]
C88  100nF  [C-0805W]
C89  0.1uF  [C-0805W]
C90  47uF  [CAPC3225X270N]
D5  1N4148 Diyot  [SOD-123]  (value not drawn)
D7  Deger: KIRMIZI LED  [SMD: LED 0805/2012 RED]  (hidden comment: Red 645nm LED Indication - Discrete 1.8V 0805)
J1  NHD-0208BZ-FL-YBW  [idc20]  (value not drawn)
R77  Deger: 10K  [R-0805W]  (hidden comment: RES SMD 10K OHM 1% 1/8W 0805)
R78  2.2K  [RESC3115X65N-2.2K-1206]
R79  Deger: 10K  [R-0805W]  (hidden comment: RES SMD 10K OHM 1% 1/8W 0805)
R80  Deger: 10K  [R-0805W]  (hidden comment: RES SMD 10K OHM 1% 1/8W 0805)
R82  Deger: 10K  [R-0805W]  (hidden comment: RES SMD 10K OHM 1% 1/8W 0805)
R83  Deger: 1M  [R-0805W]  (hidden comment: RES SMD 1M OHM 1% 1/8W 0805)
R84  Deger: 1M  [R-0805W]  (hidden comment: RES SMD 1M OHM 1% 1/8W 0805)
R114  100Ω  [R-0805W]
R115  100KΩ  [R-0805R]
R116  2.2KΩ  [R-0805W]
R117  Deger: 1K  [R-0805W]  (hidden comment: RES SMD 1K OHM 1% 1/8W 0805)
R118  33Ω  [R-0805W]
R119  0Ω  [RES 0.0 OHM 1206]
S1  Switch Tactile OFF (ON) SMD-6  [SW_1571563-7]  (value not drawn)
S2  SDA01H1SBD  [SW_SDA01H1SBD]  (value not drawn)
U4  MC33039  [SOIC127P600X175-8N]  (value not drawn)
U6  MC33035  [SOIC24(MC33035)]
U7  CD4049UBD  [SOIC127P600X175-16N]

### Blocks framed on the sheet
MC33035: C57 C62 C88-C90 D5 D7 J1 R77-R80 R82-R84 R114-R119 S1 S2 U4 U6 U7

### Nets
15V: R78.1 R79.2 R80.2 R82.2 U6.17(Vcc) U6.18(Vc) U7.1(VCC)
GND: C57.2 C62.2 C88.2 J1.8 R114.2 R117.1 R118.1 U4.7(GND) U6.15(Cur._Inv.) U6.16(Gnd) U7.6(I_=_~C) U7.7(C) U7.8(VSS) U7.9(D) U7.10(J_=_~D) U7.11(E) U7.12(K_=_~E)  [also labelled IFBA]
HIN1: J1.1 U7.2(G_=_~A)
HIN2: J1.15 U7.4(H_=_~B)
HIN3: J1.16 U7.15(L_=_~F)
LIN1: J1.11 U6.21(AB)
LIN2: J1.12 U6.20(BB)
LIN3: J1.13 U6.19(CB)
POT2: J1.9 U6.11(Er._Non.)
REFO: C90.1 J1.7 R77.2 S1.3(NO) S1.4(NO) U6.8(Ref._Out.)
SA: J1.4 U4.1(φC) U6.4(SA)
SB: J1.5 U4.2(φB) U6.5(SB)
SC: J1.6 U4.3(φA) U6.6(SC)
60-120: J1.19 U6.22(60-120)
AT: J1.2 R79.1 U6.2(AT) U7.3(A)
Brake: J1.18 U6.23(Brake)
BT: J1.14 R80.1 U6.1(BT) U7.5(B)
CT: J1.3 R82.1 U6.24(CT) U7.14(F)
Enable: J1.20 R119.1 U6.7(Out._En.)
Fwd/Rev: J1.17 U6.3(Fwd/Rev)
NetC57_1: C57.1 R83.1 U4.6(RT_/CT)
NetC62_1: C62.1 R77.1 U6.10(Oscillator)
NetC88_1: C88.1 R114.1 R117.2 R118.2 U6.9(Cur._Non.)
NetC89_1: C89.1 R84.1 R115.2 S2.COM1(COM) U6.12(Er._Inv.)
NetC89_2: C89.2 R84.2 S2.NO1(NO) U6.13(Er._Out.)
NetC90_2: C90.2 R116.1 R119.2 S1.1(COM) S1.2(COM)
NetD5_1: D5.1(A) R116.2
NetD5_2: D5.2(K) D7.2(K) U6.14(Fault)
NetD7_1: D7.1(A) R78.2
NetR83_2: R83.2 U4.8(Vcc)
NetR115_1: R115.1 U4.5(fout)

Not connected (* = marked no-connect by the designer): J1 10; U4 4(φA')

### Library data of the parts
C57 = CAP 750pF 0603 SMD: MP: C0603C751J3GAC7867; Package: None; Price: None; Value: *; Availability: Unavailable
C62 = CAP 10nF 0805: .01UF 25V 10% 0806; MP: C0805C103K3RACTU; Package: None; Price: None; Value: *; Availability: Unavailable
C88 = CAP 100nF 50V SMT 0805: as C31 on sheet Mosfet_cct; Availability: Warning; Mouser-Purchase-URL: https://snapeda.com/shop?store=Mouser&id=4217223; Price: None; DigiKey-Purchase-URL: https://snapeda.com/shop?store=DigiKey&id=4217223; Package: 0805 Wurth Electronics; Value: *; SnapEDA_Link: https://www.snapeda.com/parts/885012207098/Wurth%20Electronics%20Inc/view-part/4217223/?ref=snap; BuyPart: https://www.snapeda.com/parts/885012207098/Wurth%20Electronics%20Inc/view-part/4217223/?ref=eda
C89 = CAP 0.1uF SMD 0805: Cap Ceramic 0.1uF 35V X7R 10% SMD 0805 125Â°C Paper T/R; MP: C0805C104K6RACTU; MF: KEMET; SnapEDA_Link: https://www.snapeda.com/parts/C0805C104K6RACTU/KEMET/view-part/2037626/?ref=snap; Value: *; Availability: Unavailable; Package: 0805 KEMET; Price: None
C90 = CAP 47uF 3225 SMD: CAP, MLCC, AUTO, X7R, 47UF/6.3V, 1210; MP: GRT32ER70J476KE13L; Package: None; Price: None; Value: *; Availability: Unavailable
D5 = 1N4148: as D9 on sheet Mosfet_cct; Cins: Diyot; Kılıf: SOD123; MSL: 1 (Unlimited); Deger: 1N4148
D7 = LED_Kırmızı: LED RED DIFFUSED 0805 SMD; Uretici Kodu: LH R974-LP-1; Kılıf: 0805; -Sicaklik: -40; +Sicaklik: +125; Cins: LED; Lehim Yöntemi: SMD; MSL: 1 (Unlimited)
J1 = IDC-20
R77 R79 R80 R82 = 10K 0805: as R6 on sheet Mosfet_cct; Lehim Yöntemi: SMD; MSL: 1 (Unlimited)
R78 = RES 2.2K 1206: RES SMD 2.2K OHM 1% 1/4W 1206; MP: CRG1206F2K2/10; Package: None; Price: None; Value: *; Availability: Unavailable
R83 R84 = 1M 0805: 1 MOhms ±1% 0.125W, 1/8W Chip Resistor 0805 (2012 Metric) Moisture Resistant Thick Film; Cins: Direnc; Uretici Kodu: RC0805FR-071ML; Kılıf: 0805; -Sicaklik: -55; +Sicaklik: +155; Lehim Yöntemi: SMD; MSL: 1 (Unlimited)
R114 = RES 100Ω 0805
R115 = RES 100KΩ 0805
R116 = RES 2.2KΩ 0805
R117 = 1K 0805: as R75 on sheet Regulator_cct; Lehim Yöntemi: SMD; MSL: 1 (Unlimited)
R118 = RES 33Ω 0805
R119 = RES 0.0 Ω 1206
S1 = Switch Tactile OFF (ON) SMD-6: Switch Tactile OFF (ON) SPST Round Button Gull Wing 0.05A 24VDC 1VA 0.98N SMD Loose; MF: TE Connectivity; MP: 1571563-7; Value: *; Availability: Unavailable; Price: None; SnapEDA_Link: https://www.snapeda.com/parts/1571563-7/TE%20Connectivity/view-part/2365663/?ref=snap; EU_RoHS_Compliance: Compliant; Package: SMD-6 Omron Electronics
S2 = SDA01H1SBD: Dip Switch SPST 1 Position Surface Mount Slide (Standard) Actuator 25mA 24VDC; MF: C&K; MP: SDA01H1SBD; Purchase-URL: https://pricing.snapeda.com/search/part/SDA01H1SBD/?ref=eda; SnapEDA_Link: https://www.snapeda.com/parts/SDA01H1SBD/C&K/view-part/2598524/?ref=snap; Price: None; Package: None; Value: *; Availability: Good; Check_prices: https://www.snapeda.com/parts/SDA01H1SBD/C&K/view-part/2598524/?ref=eda
U7 = CD4049UBD: CMOS Hex Inverting Buffer/Converter 16-SOIC -55 to 125; MF: Texas Instruments; Value: *; Price: None; Package: SOIC-16 Texas Instruments; SnapEDA_Link: https://www.snapeda.com/parts/CD4049UBD/Texas%20Instruments/view-part/291752/?ref=snap; Availability: Good; Purchase-URL: https://pricing.snapeda.com/search/part/CD4049UBD/?ref=eda; MP: CD4049UBD; Check_prices: https://www.snapeda.com/parts/CD4049UBD/Texas%20Instruments/view-part/291752/?ref=eda

## Nets that join several sheets
15V: Gate_Driver_cct (15 pins), Regulator_cct (C58.1 L1.2 R76.2), MC33035_cct (7 pins)
+24V: Mosfet_cct (20 pins), Regulator_cct (R73.2 R74.2), Parallel_Capacitor (24 pins)
GND: Mosfet_cct (42 pins), Gate_Driver_cct (15 pins), Regulator_cct (5 pins), Parallel_Capacitor (24 pins), MC33035_cct (17 pins)
HIN1: Gate_Driver_cct (U1.12), MC33035_cct (J1.1 U7.2)
HIN2: Gate_Driver_cct (U2.12), MC33035_cct (J1.15 U7.4)
HIN3: Gate_Driver_cct (U3.12), MC33035_cct (J1.16 U7.15)
LIN1: Gate_Driver_cct (U1.14), MC33035_cct (J1.11 U6.21)
LIN2: Gate_Driver_cct (U2.14), MC33035_cct (J1.12 U6.20)
LIN3: Gate_Driver_cct (U3.14), MC33035_cct (J1.13 U6.19)
Source_1: Mosfet_cct (12 pins), Gate_Driver_cct (C49.2 U1.6)
Source_2: Mosfet_cct (12 pins), Gate_Driver_cct (C50.2 U2.6)
Source_3: Mosfet_cct (12 pins), Gate_Driver_cct (C51.2 U3.6)
NetD9_2: Mosfet_cct (8 pins), Gate_Driver_cct (U1.8)
NetD13_2: Mosfet_cct (8 pins), Gate_Driver_cct (U2.8)
NetD17_2: Mosfet_cct (8 pins), Gate_Driver_cct (U3.8)
NetD21_2: Mosfet_cct (8 pins), Gate_Driver_cct (U1.1)
NetD25_2: Mosfet_cct (8 pins), Gate_Driver_cct (U2.1)
NetD27_2: Mosfet_cct (8 pins), Gate_Driver_cct (U3.1)